# EAGLE design power supply (EAGLE 6.6.0)
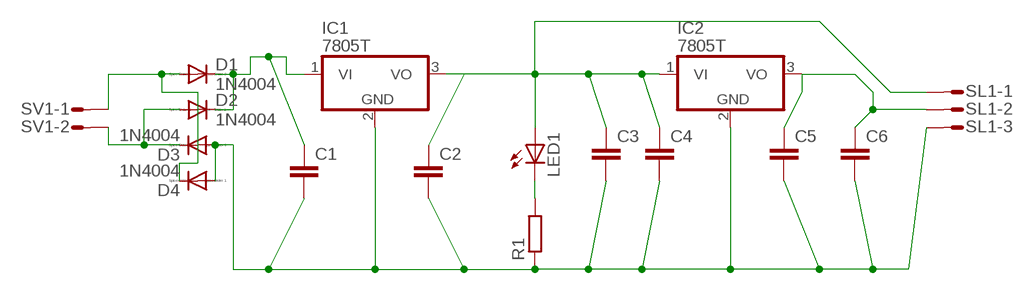
[diagram p0: schematic, sheet 1]

## Parts
C1  C5/5.5  [C5B5.5]
C2  C5/5.5  [C5B5.5]
C3  C5/5.5  [C5B5.5]
C4  C5/5.5  [C5B5.5]
C5  C5/5.5  [C5B5.5]
C6  C5/5.5  [C5B5.5]
D1  1N4004  [DO41-10]
D2  1N4004  [DO41-10]
D3  1N4004  [DO41-10]
D4  1N4004  [DO41-10]
IC1  7805T  [TO220H]
IC2  7805T  [TO220H]
LED1  LED5MM  [LED5MM]
R1  R-EU_0207/7  [0207/7]
SL1  M03S  [03P]
SV1  L02P  [L02P]

## Nets
N$1: C1.1 D1.C D2.C IC1.1(VI)
N$2: C1.2 C2.2 C3.2 C4.2 C5.2 C6.2 D3.A D4.A IC1.2(GND) IC2.2(GND) R1.1 SL1.3
N$3: D2.A D3.C SV1.2
N$4: D1.A D4.C SV1.1
N$7: C2.1 C3.1 C4.1 IC1.3(VO) IC2.1(VI) LED1.A SL1.1
N$8: LED1.K(C) R1.2
N$12: C5.1 C6.1 IC2.3(VO) SL1.2

## Library data of the parts
C1-C6 = capacitor-wima:C: CAPACITOR naming: grid - package width
D1-D4 = diode:1N4004: DIODE general purpose rectifier, 1 A
IC1 IC2 = linear:78*: Positive VOLTAGE REGULATOR Source: http://cache.national.com/ds/LM/LM78L05.pdf http://www.fairchildsemi.com/ds/LM/LM7805.pdf
LED1 = led:LED: LED OSRAM: - CHIPLED LG R971, LG N971, LY N971, LG Q971, LY Q971, LO R971, LY R971 LH N974, LH R974 LS Q976, LO Q976, LY Q976 LO Q996 - Hyper CHIPLED LW Q18S LB Q993, LB Q99A, LB R99A - SideLED LS A670, LO A670, LY A670, LG A670, LP A670 LB A673, LV A673, LT A673, LW A673 LH A674 LY A675 LS A676, LA A676, LO A676, LY A676, LW A676 LS A679, LY A679, LG A679 - Hyper Micro SIDELED® LS Y876, LA Y876, LO Y876, LY Y876 LT Y87S - SmartLED LW L88C, LW L88S LB L89C, LB L89S, LG L890 LS L89K, LO L89K, LY L89K LS L896, LA L896, LO L896, LY L896 - TOPLED LS T670, LO T670, LY T670, LG T670, LP T670 LSG T670, LSP T670, LSY T670, LOP T670, LYG T670 LG T671, LOG T671, LSG T671 LB T673, LV T673, LT T673, LW T673 LH T674 LS T676, LA T676, LO T676, LY T676, LB T676, LH T676, LSB T676, LW T676 LB T67C, LV T67C, LT T67C, LS T67K, LO T67K, LY T67K, LW E67C LS E67B, LA E67B, LO E67B, LY E67B, LB E67C, LV E67C, LT E67C LW T67C LS T679, LY T679, LG T679 LS T770, LO T770, LY T770, LG T770, LP T770 LB T773, LV T773, LT T773, LW T773 LH T774 LS E675, LA E675, LY E675, LS T675 LS T776, LA T776, LO T776, LY T776, LB T776 LHGB T686 LT T68C, LB T68C - Hyper Mini TOPLED® LB M676 - Mini TOPLED Santana® LG M470 LS M47K, LO M47K, LY M47K Source: http://www.osram.convergy.de LUXEON: - LUMILED® LXK2-PW12-R00, LXK2-PW12-S00, LXK2-PW14-U00, LXK2-PW14-V00 LXK2-PM12-R00, LXK2-PM12-S00, LXK2-PM14-U00 LXK2-PE12-Q00, LXK2-PE12-R00, LXK2-PE12-S00, LXK2-PE14-T00, LXK2-PE14-U00 LXK2-PB12-K00, LXK2-PB12-L00, LXK2-PB12-M00, LXK2-PB14-N00, LXK2-PB14-P00, LXK2-PB14-Q00 LXK2-PR12-L00, LXK2-PR12-M00, LXK2-PR14-Q00, LXK2-PR14-R00 LXK2-PD12-Q00, LXK2-PD12-R00, LXK2-PD12-S00 LXK2-PH12-R00, LXK2-PH12-S00 LXK2-PL12-P00, LXK2-PL12-Q00, LXK2-PL12-R00 Source: www.luxeon.com KINGBRIGHT: KA-3528ASYC Source: www.kingbright.com
R1 = rcl:R-EU_: RESISTOR, European symbol
SL1 = con-amp-quick:M03S: AMP QUICK CONNECTOR; OC_FARNELL: unknown; OC_NEWARK: unknown
SV1 = con-amp-mt:L02P: AMP MT CONNECTOR; OC_FARNELL: unknown; OC_NEWARK: unknown

## Board
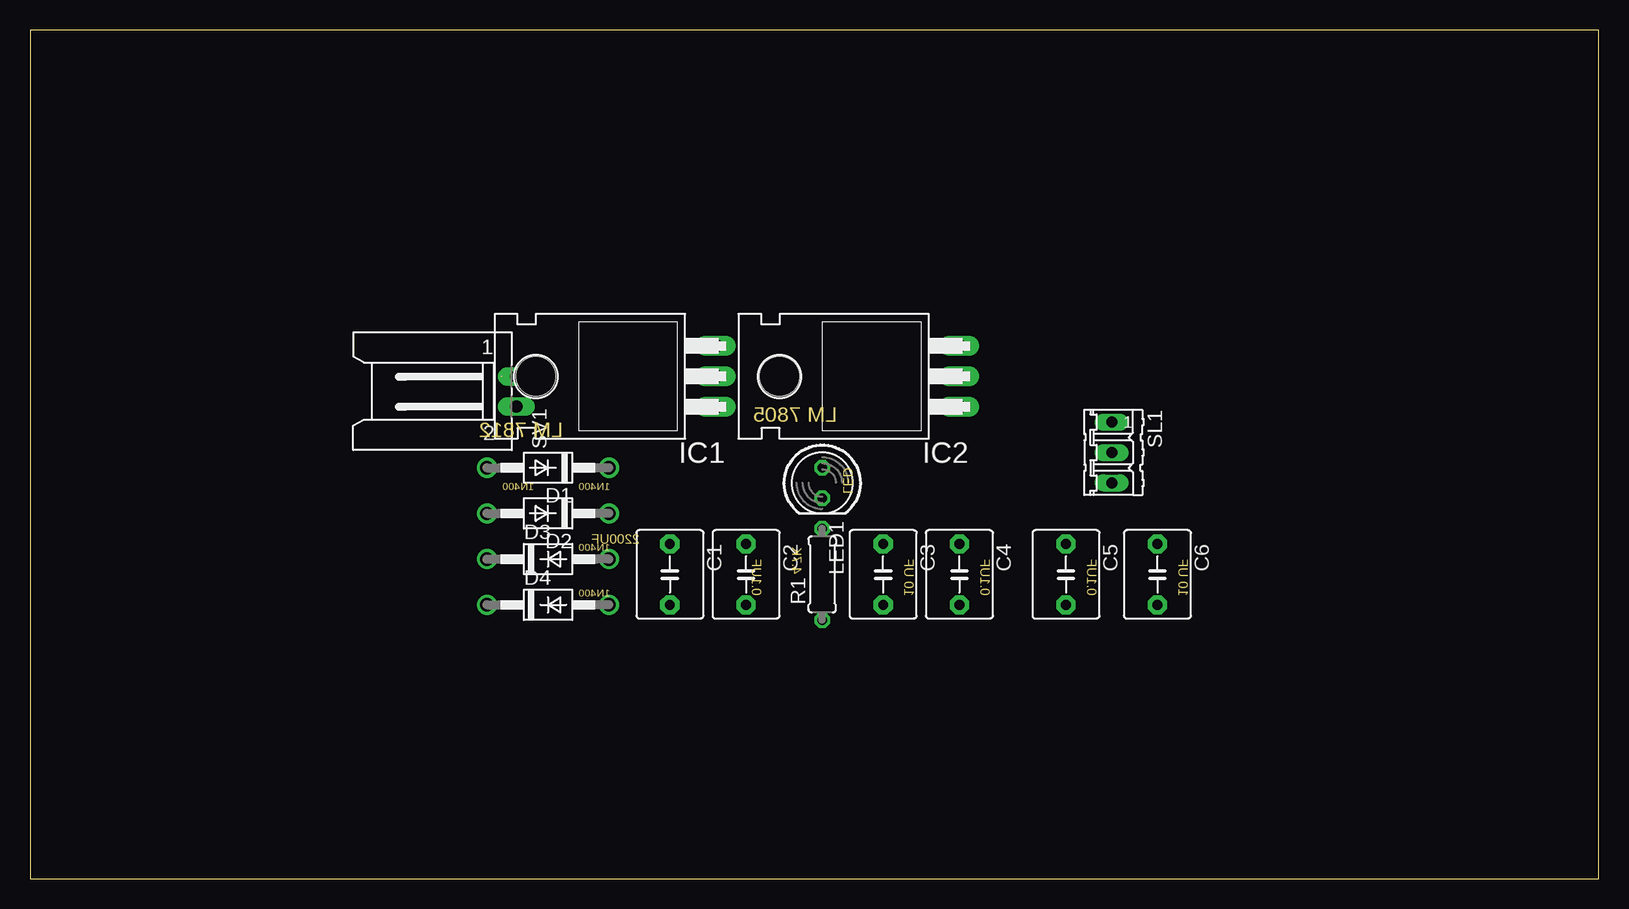
[diagram p1: board, top side]
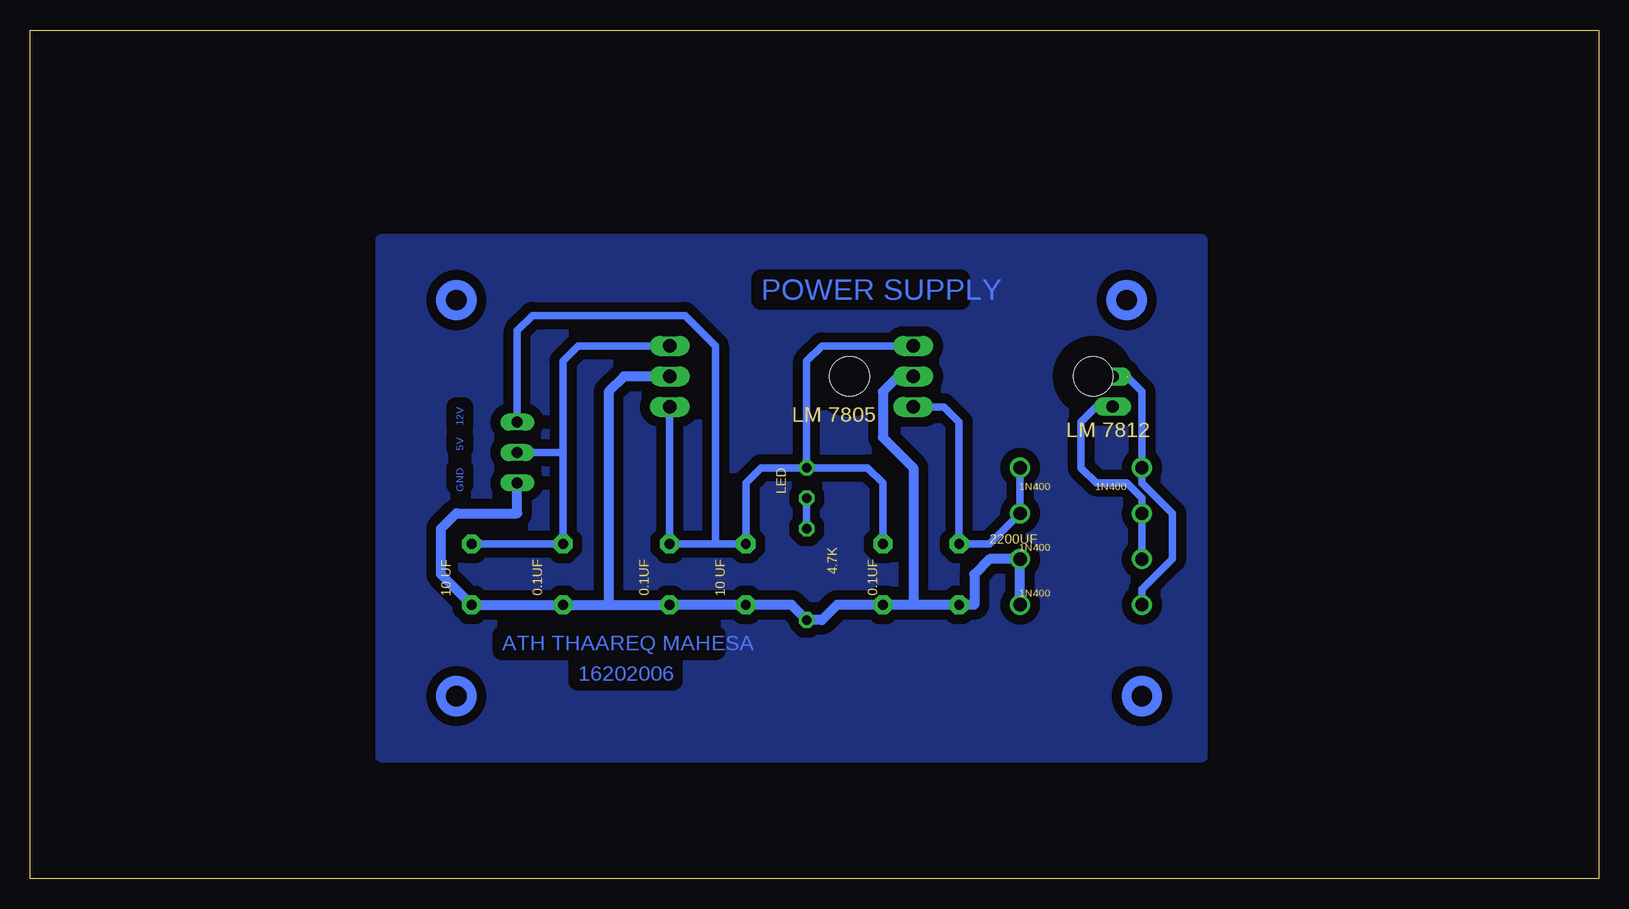
[diagram p2: board, bottom side, seen from below]

Size 130.79 x 70.79 mm. Coordinates in mm from the lower left corner, seen from the top.
Outline: 0,0 130.79,0 130.79,70.79 0,70.79 0,0
Copper layers (1*16): Top 0.035mm / dielectric 1.5mm / Bottom 0.035mm
Design rules "default": minimum track width 10mil, minimum drill 24mil, track to track 8mil, track to pad 8mil, pad to pad 8mil, via to via 8mil, smd to smd 8mil, copper to edge 40mil, drill to drill 8mil, minimum pad ring 10mil, minimum via ring 8mil, stop-mask expansion 4mil, vias tented up to drill 0mil, thermal gap 10mil

### Footprints (pad centres in the part's own frame; a part is rotated, then mirrored left to right if it is on the bottom)
C5B5.5 = drill 0.813 pad 1.6 octagon: 1 -2.54,0; 2 2.54,0
DO41-10 = drill 1.118: A 5.08,0; C -5.08,0
TO220H = drill 1.118 long: 1 -2.54,-10.16; 2 0,-10.16; 3 2.54,-10.16 | hole 3.302: 0,4.826
LED5MM = drill 0.813 octagon: A -1.27,0; K 1.27,0
0207/7 = drill 0.813 octagon: 1 -3.81,0; 2 3.81,0
03P = drill 0.914 long: 1 -2.54,0; 2 0,0; 3 2.54,0
L02P = drill 1.016 long: 1 1.25,-6.25; 2 -1.25,-6.25

### Placement (x,y rotation side)
C1  53.34,25.4 270 top
C2  59.69,25.4 270 top
C3  71.12,25.4 270 top
C4  77.47,25.4 270 top
C5  86.36,25.4 270 top
C6  93.98,25.4 270 top
D1  43.18,34.29 180 top
D2  43.18,30.48 180 top
D3  43.18,26.67 0 top
D4  43.18,22.86 0 top
IC1  46.99,41.91 90 top
IC2  67.31,41.91 90 top
LED1  66.04,33.02 270 top
R1  66.04,25.4 90 top
SL1  90.17,35.56 270 top
SV1  34.29,40.64 90 top

### Tracks (layer width: path | path; a pad name or v marks a point on that pad's centre or on a via)
N$1
  Bottom 0.61: IC1.1 54.61,39.37 53.34,38.1 C1.1 50.8,27.94 D2.C D1.C
N$2
  Bottom 0.813: D4.A D3.A 50.8,26.67 52.07,25.4 52.07,22.86 C1.2 57.15,22.86 | 57.15,22.86 C2.2 63.5,22.86 64.77,21.59 R1.1 67.31,22.86 C3.2 C4.2 82.55,22.86 | 82.55,22.86 C5.2 C6.2 96.52,25.4 96.52,29.21 95.25,30.48 90.17,30.48 SL1.3 | IC1.2 58.42,41.91 59.69,40.64 59.69,36.83 57.15,34.29 57.15,22.86 | IC2.2 81.28,41.91 82.55,40.64 82.55,22.86
N$3
  Bottom 0.61: D3.C D2.A 38.1,31.75 39.37,33.02 41.91,33.02 43.18,34.29 43.18,38.1 41.89,39.39 SV1.2
N$4  (1 unrouted)
  Bottom 0.406: SV1.1 39.29,41.91
  Bottom 0.61: 41.91,41.91 39.37,41.91 38.1,40.64 D1.A 38.1,33.02 35.56,30.48 35.56,26.67 38.1,24.13 D4.C
N$5
  pour Bottom (isolate 0.813, no thermals): 38.1,53.34 101.6,53.34 101.6,52.07 101.6,10.16 33.02,10.16 33.02,53.34
N$7
  Bottom 0.61: IC2.1 C4.1 73.66,27.94 | 73.66,27.94 C3.1 71.12,33.02 69.85,34.29 LED1.A | LED1.A 66.04,43.18 64.77,44.45 IC1.3 | LED1.A 60.96,34.29 59.69,33.02 C2.1 | 73.66,27.94 73.66,44.45 76.2,46.99 88.9,46.99 90.17,45.72 SL1.1
N$8
  Bottom 0.61: R1.2 LED1.K
N$12
  Bottom 0.61: C6.1 C5.1 86.36,35.56 | 86.36,35.56 86.36,43.18 85.09,44.45 IC2.3 | SL1.2 86.36,35.56
(copper drawn outside any net)
  shapes: Bottom circle x4

### Text on the board
Bottom: POWER SUPPLY | 12V | 5V | GND | ATH THAAREQ MAHESA | 16202006
Dimension: LM 7805 | LM 7812 | LED | 1N400 | 1N400 | 1N400 | 2200UF | 0.1UF | 10 UF | 0.1UF | 0.1UF | 10 UF | 4.7K | 1N400